# Altium schematic sheet 06 - JTAG.SchDoc
size A3; SheetNumber: 6; SheetTotal: 7
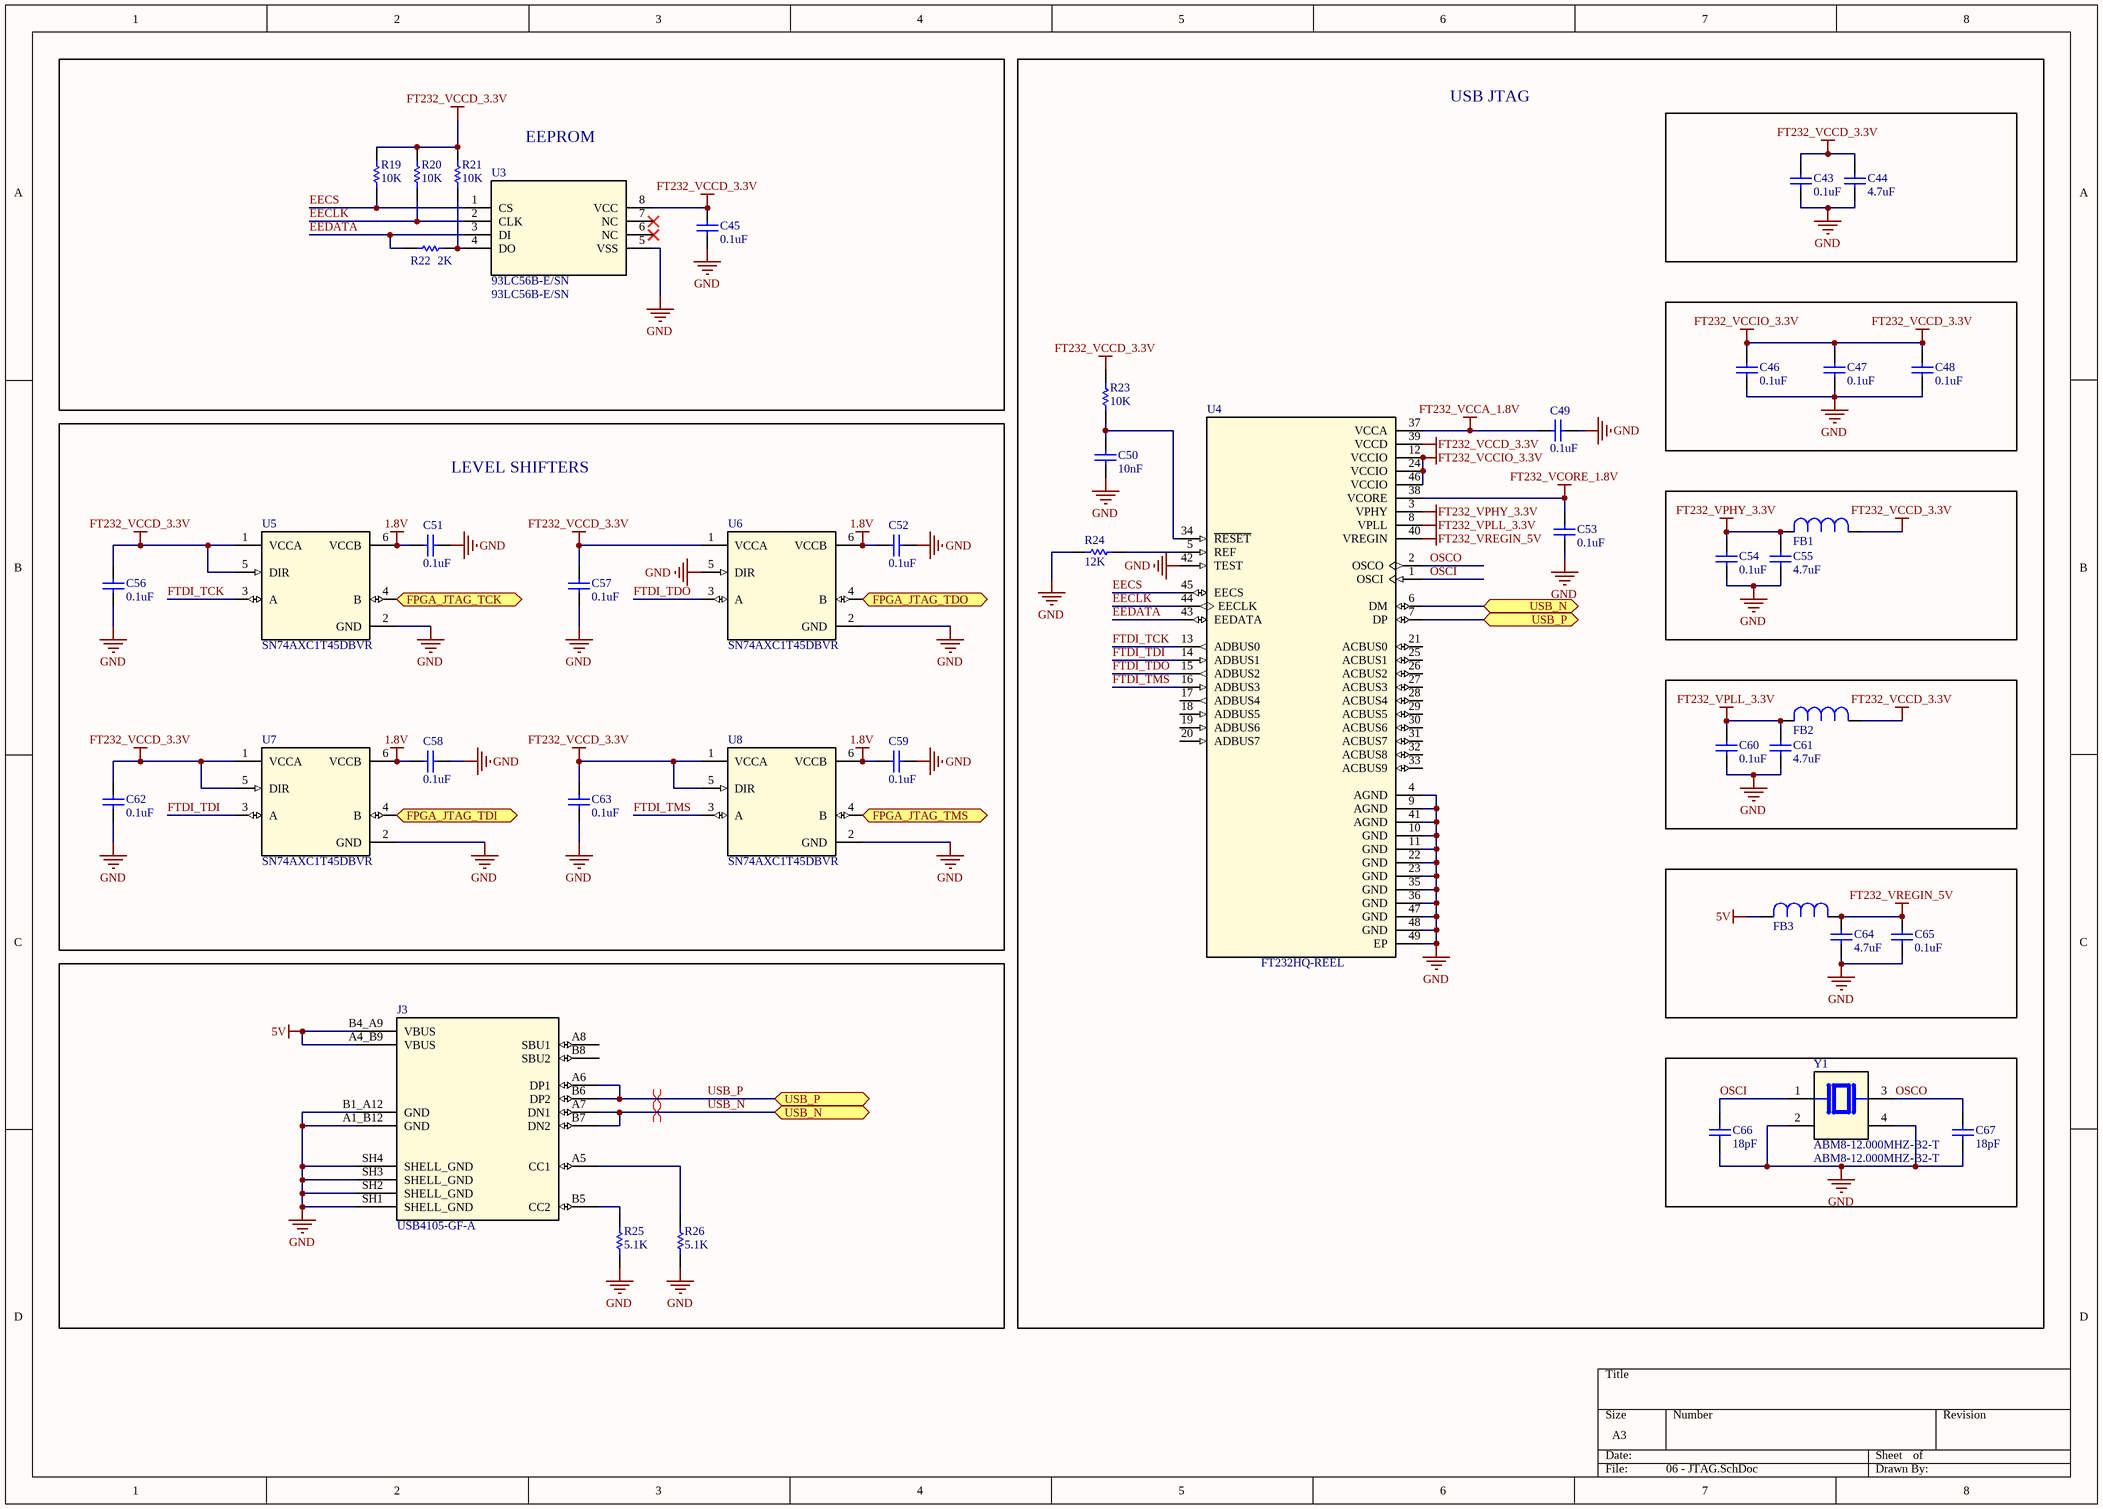
[diagram p0: 06 - JTAG.SchDoc]

## Parts
C43  value 0.1uF  [0402-C-R]  (hidden comment: GRM155R61E104KA87D)
C44  value 4.7uF  [0402-C-R]  (hidden comment: GRM155D81C475ME15J)
C45  value 0.1uF  [0402-C-R]  (hidden comment: GRM155R61E104KA87D)
C46  value 0.1uF  [0402-C-R]  (hidden comment: GRM155R61E104KA87D)
C47  value 0.1uF  [0402-C-R]  (hidden comment: GRM155R61E104KA87D)
C48  value 0.1uF  [0402-C-R]  (hidden comment: GRM155R61E104KA87D)
C49  value 0.1uF  [0402-C-R]  (hidden comment: GRM155R61E104KA87D)
C50  value 10nF  [0402-C-R]  (hidden comment: KGM05AR71E103KH)
C51  value 0.1uF  [0402-C-R]  (hidden comment: GRM155R61E104KA87D)
C52  value 0.1uF  [0402-C-R]  (hidden comment: GRM155R61E104KA87D)
C53  value 0.1uF  [0402-C-R]  (hidden comment: GRM155R61E104KA87D)
C54  value 0.1uF  [0402-C-R]  (hidden comment: GRM155R61E104KA87D)
C55  value 4.7uF  [0402-C-R]  (hidden comment: GRM155D81C475ME15J)
C56  value 0.1uF  [0402-C-R]  (hidden comment: GRM155R61E104KA87D)
C57  value 0.1uF  [0402-C-R]  (hidden comment: GRM155R61E104KA87D)
C58  value 0.1uF  [0402-C-R]  (hidden comment: GRM155R61E104KA87D)
C59  value 0.1uF  [0402-C-R]  (hidden comment: GRM155R61E104KA87D)
C60  value 0.1uF  [0402-C-R]  (hidden comment: GRM155R61E104KA87D)
C61  value 4.7uF  [0402-C-R]  (hidden comment: GRM155D81C475ME15J)
C62  value 0.1uF  [0402-C-R]  (hidden comment: GRM155R61E104KA87D)
C63  value 0.1uF  [0402-C-R]  (hidden comment: GRM155R61E104KA87D)
C64  value 4.7uF  [0402-C-R]  (hidden comment: GRM155D81C475ME15J)
C65  value 0.1uF  [0402-C-R]  (hidden comment: GRM155R61E104KA87D)
C66  value 18pF  [0402-C-R]  (hidden comment: GRM1555C1H180JA01D)
C67  value 18pF  [0402-C-R]  (hidden comment: GRM1555C1H180JA01D)
FB1  BLM15HD182SN1D  [0402-F-R]  (value not drawn)
FB2  BLM15HD182SN1D  [0402-F-R]  (value not drawn)
FB3  BLM15HD182SN1D  [0402-F-R]  (value not drawn)
J3  PN: USB4105-GF-A  [GCT_USB4105-GF-A]  (hidden comment: CONN RCP USB2.0 TYP C 24P SMD RA)
R19  value 10K  [0402-R-R]  (hidden comment: RC0402FR-0710KL)
R20  value 10K  [0402-R-R]  (hidden comment: RC0402FR-0710KL)
R21  value 10K  [0402-R-R]  (hidden comment: RC0402FR-0710KL)
R22  value 2K  [0402-R-R]  (hidden comment: RMCF0402FT2K00)
R23  value 10K  [0402-R-R]  (hidden comment: RC0402FR-0710KL)
R24  value 12K  [0402-R-R]  (hidden comment: RMCF0402FT12K0)
R25  value 5.1K  [0402-R-R]  (hidden comment: RMCF0402FT5K10)
R26  value 5.1K  [0402-R-R]  (hidden comment: RMCF0402FT5K10)
U3  93LC56B-E/SN  [93LC56B-E/SN]
U4  PN: FT232HQ-REEL  [FT232HQ]  (hidden comment: IC HS USB TO UART/FIFO 48QFN)
U5  SN74AXC1T45DBVR  [SN74AXC1T45DBVR]
U6  SN74AXC1T45DBVR  [SN74AXC1T45DBVR]
U7  SN74AXC1T45DBVR  [SN74AXC1T45DBVR]
U8  SN74AXC1T45DBVR  [SN74AXC1T45DBVR]
Y1  ABM8-12.000MHZ-B2-T  [XTAL_ABM8-12.000MHZ-B2-T]

## Blocks framed on the sheet
EEPROM: C45 R19-R22 U3
USB JTAG: C43 C44 C46-C50 C53-C55 C60 C61 C64-C67 FB1-FB3 R23 R24 U4 Y1
LEVEL SHIFTERS: C51 C52 C56-C59 C62 C63 U5-U8

## Ports
FPGA_JTAG_TCK (bidir), FPGA_JTAG_TDI (bidir), FPGA_JTAG_TDO (bidir), FPGA_JTAG_TMS (bidir), USB_N (bidir), USB_P (bidir)

## Nets
1.8V: C51.2 C52.2 C58.2 C59.2 U5.6(VCCB) U6.6(VCCB) U7.6(VCCB) U8.6(VCCB)
5V: FB3.2 J3.A4_B9(VBUS) J3.B4_A9(VBUS)
FT232_VCCA_1.8V: C49.2 U4.37(VCCA)
FT232_VCCD_3.3V: C43.2 C44.2 C45.2 C46.2 C47.2 C48.2 C56.2 C57.2 C62.2 C63.2 FB1.1 FB2.1 R19.2 R20.2 R21.2 R23.2 U3.8(VCC) U4.12(VCCIO) U4.24(VCCIO) U4.39(VCCD) U4.46(VCCIO) U5.1(VCCA) U5.5(DIR) U6.1(VCCA) U7.1(VCCA) U7.5(DIR) U8.1(VCCA) U8.5(DIR)  [also labelled FT232_VCCIO_3.3V]
FT232_VCORE_1.8V: C53.1 U4.38(VCORE)
FT232_VPHY_3.3V: C54.2 C55.2 FB1.2 U4.3(VPHY)
FT232_VPLL_3.3V: C60.2 C61.2 FB2.2 U4.8(VPLL)
FT232_VREGIN_5V: C64.2 C65.2 FB3.1 U4.40(VREGIN)
GND: C43.1 C44.1 C45.1 C46.1 C47.1 C48.1 C49.1 C50.1 C51.1 C52.1 C53.2 C54.1 C55.1 C56.1 C57.1 C58.1 C59.1 C60.1 C61.1 C62.1 C63.1 C64.1 C65.1 C66.1 C67.1 J3.A1_B12(GND) J3.B1_A12(GND) J3.SH1(SHELL_GND) J3.SH2(SHELL_GND) J3.SH3(SHELL_GND) J3.SH4(SHELL_GND) R24.1 R25.1 R26.1 U3.5(VSS) U4.4(AGND) U4.9(AGND) U4.10(GND) U4.11(GND) U4.22(GND) U4.23(GND) U4.35(GND) U4.36(GND) U4.41(AGND) U4.42(TEST) U4.47(GND) U4.48(GND) U4.49(EP) U5.2(GND) U6.2(GND) U6.5(DIR) U7.2(GND) U8.2(GND) Y1.2(GND) Y1.4(GND)
EECLK: R20.1 U3.2(CLK) U4.44(EECLK)
EECS: R19.1 U3.1(CS) U4.45(EECS)
EEDATA: R22.1 U3.3(DI) U4.43(EEDATA)
FPGA_JTAG_TCK: U5.4(B) ; port FPGA_JTAG_TCK
FPGA_JTAG_TDI: U7.4(B) ; port FPGA_JTAG_TDI
FPGA_JTAG_TDO: U6.4(B) ; port FPGA_JTAG_TDO
FPGA_JTAG_TMS: U8.4(B) ; port FPGA_JTAG_TMS
FTDI_TCK: U4.13(ADBUS0) U5.3(A)
FTDI_TDI: U4.14(ADBUS1) U7.3(A)
FTDI_TDO: U4.15(ADBUS2) U6.3(A)
FTDI_TMS: U4.16(ADBUS3) U8.3(A)
OSCI: C66.2 U4.1(OSCI) Y1.1
OSCO: C67.2 U4.2(OSCO) Y1.3
USB_N: J3.A7(DN1) J3.B7(DN2) U4.6(DM) ; port USB_N
USB_P: J3.A6(DP1) J3.B6(DP2) U4.7(DP) ; port USB_P
NetC50_2: C50.2 R23.1 U4.34(~{RESET})
NetJ3_A5: J3.A5(CC1) R26.2
NetJ3_B5: J3.B5(CC2) R25.2
NetR21_1: R21.1 R22.2 U3.4(DO)
NetR24_2: R24.2 U4.5(REF)

Not connected (* = marked no-connect by the designer): J3 A8(SBU1) B8(SBU2); U3 6(NC)* 7(NC)*; U4 17(ADBUS4) 18(ADBUS5) 19(ADBUS6) 20(ADBUS7) 21(ACBUS0) 25(ACBUS1) 26(ACBUS2) 27(ACBUS3) 28(ACBUS4) 29(ACBUS5) 30(ACBUS6) 31(ACBUS7) 32(ACBUS8) 33(ACBUS9)

## Layout directives
differential pair: USB_N, USB_P

## Library data of the parts
C43 C45-C49 C51-C54 C56-C60 C62 C63 C65 = CAP CER 0.1UF 25V X5R 0402: 0.1 µF ±10% 25V Ceramic Capacitor X5R 0402 (1005 Metric); SIZE: 0402; PN: GRM155R61E104KA87D; VOLTAGE: 25V; TOLERANCE: 10%
C44 = CAP CER 4.7UF 10V X5R 0402: CAP SMD 0402 MLCC GERAL 4.7uF 25V ±20% 0402 X5s PN: GRM155D81C475ME15J MURATA; SIZE: 0402; VOLTAGE: 25V; TOLERANCE: 20%; PN: GRM155D81C475ME15J
C50 = CAP CER 10nF 25V X7R 0402: 10000 pF ±10% 25V Ceramic Capacitor X7R 0402 (1005 Metric); SIZE: 0402; VOLTAGE: 25V; TOLERANCE: 10%; PN: KGM05AR71E103KH
C55 C61 C64 = CAP CER 4.7UF 25V X5R 0402: CAP SMD 0402 MLCC GERAL 4.7uF 25V ±20% 0402 X5s PN: GRM155D81C475ME15J MURATA; SIZE: 0402; VOLTAGE: 25V; TOLERANCE: 20%; PN: GRM155D81C475ME15J
C66 C67 = CAP CER 18PF 50V C0G/NP0 0402: 18 pF ±5% 50V Capacitor de cerâmica C0G, NP0 0402 (métrico 1005)PN:GRM1555C1H180JA01D MURATA; SIZE: 0402; VOLTAGE: 50V; TOLERANCE: 5%; PN: GRM1555C1H180JA01D
FB1-FB3 = FERRITE BEAD 1.8K OHM 0402 1LN: FERRITE BEAD 1.8K OHM 0402 1LN PN: BLM15HD182SN1D; Mfr_Name: Murata; PN: BLM15HD182SN1D
J3 = CONN RCP USB2.0 TYP C 24P SMD RA: CONN RCP USB2.0 TYP C 24P SMD RA PN: USB4105-GF-A; MF: {'manufacturer': u'GCT'}; Package: None; Price: None; Availability: Unavailable; Value: *
R19-R21 R23 = RES 10K OHM 1% 1/16W 0402: 10 kOhms ±1% 0,063W, 1/16W Resistor de chip 0402 (métrico 1005) Resistente à umidade Filme grosso; PACK: 0402; POWER: 0.063W; TOLERANCE: 1%; PN: RC0402FR-0710KL
R22 = RES SMD 0402 2K 0.063W ±1%: RES SMD GERAL FILM 2K 0.063W ±1% 0402 7" TAPE PN: RMCF0402FT2K00 STACKPOLE; PACK: 0402; POWER: 0.063W; TOLERANCE: 1%; PN: RMCF0402FT2K00
R24 = RES SMD 0402 12K 0.063W ±1%: RES SMD GERAL FILM 12K 0.063W ±1% 0402 7" TAPE PN: RMCF0402FT12K0; PACK: 0402; POWER: 0.063W; TOLERANCE: 1%; PN: RMCF0402FT12K0
R25 R26 = RES SMD 0402 5.1K OHM 1% 1/16W: RES SMD 0402 5.1K OHM 1% 1/16W 0402 PN: RMCF0402FT5K10; PACK: 0402; TOLERANCE: 0.1%; POWER: 0.063W; PN: RMCF0402FT5K10
U3 = IC EEPROM 2KBIT MICROWIRE 8SOIC: EEPROM CI de memória 2Kbit Microwire 2 MHz 8-SOIC. PN: 93LC56B-E/SN; Mfr_Name: Microchip; RefDes: RefDes; Type: Type; PN: 93LC56B-E/SN
U4 = IC HS USB TO UART/FIFO 48QFN: USB Bridge, USB to UART,FIFO USB 2.0 UART, FIFO Interface 48-QFN (8x8) PN: FT232HQ-REEL; MF: FTDI, Future; MP: FT232HQ-REEL; SnapEDA_Link: https://www.snapeda.com/parts/FT232HQ-REEL/FTDI,%20Future%20Technology%20Devices%20International%20Ltd/view-part/52946/?ref=snap; Check_prices: https://www.snapeda.com/parts/FT232HQ-REEL/FTDI,%20Future%20Technology%20Devices%20International%20Ltd/view-part/52946/?ref=eda; Price: None; Availability: Good; Purchase-URL: https://pricing.snapeda.com/search/part/FT232HQ-REEL/?ref=eda; Package: QFN-48 FTDI; Value: *
U5-U8 = IC TRANSLATOR BIDIR SOT23-6: Nível de tensão Tradutor Bidirecional 1 Circuito 1 Canal 500Mbps SOT-23-6. PN: SN74AXC1T45DBVR; MF: Texas Instruments; SnapEDA_Link: https://www.snapeda.com/parts/SN74AXC1T45DBVR/Texas+Instruments/view-part/?ref=snap; Availability: In Stock; MP: SN74AXC1T45DBVR; Price: None; Purchase-URL: https://pricing.snapeda.com/search/part/SN74AXC1T45DBVR/?ref=eda; Check_prices: https://www.snapeda.com/parts/SN74AXC1T45DBVR/Texas+Instruments/view-part/?ref=eda; Package: SOT-23-6 Texas Instruments; Parameter 1: *; Value: *; PN: SN74AXC1T45DBVR
Y1 = CRYSTAL 12.0000MHZ 18PF SMD: 12 MHz ±20ppm Cristal 18pF 120 Ohms 4-SMD, sem condutores PN: ABM8-12.000MHZ-B2-T; MF: Abracon; SnapEDA_Link: https://www.snapeda.com/parts/ABM8-12.000MHZ-B2-T/Abracon+LLC/view-part/?ref=snap; Price: None; Value: *; MP: ABM8-12.000MHZ-B2-T; Check_prices: https://www.snapeda.com/parts/ABM8-12.000MHZ-B2-T/Abracon+LLC/view-part/?ref=eda; Availability: In Stock; Package: NON-STANDARD-4 Abracon; Purchase-URL: https://pricing.snapeda.com/search/part/ABM8-12.000MHZ-B2-T/?ref=eda; PN: ABM8-12.000MHZ-B2-T